# EAGLE board robot_board (EAGLE 6.5.0), part 1 of 2
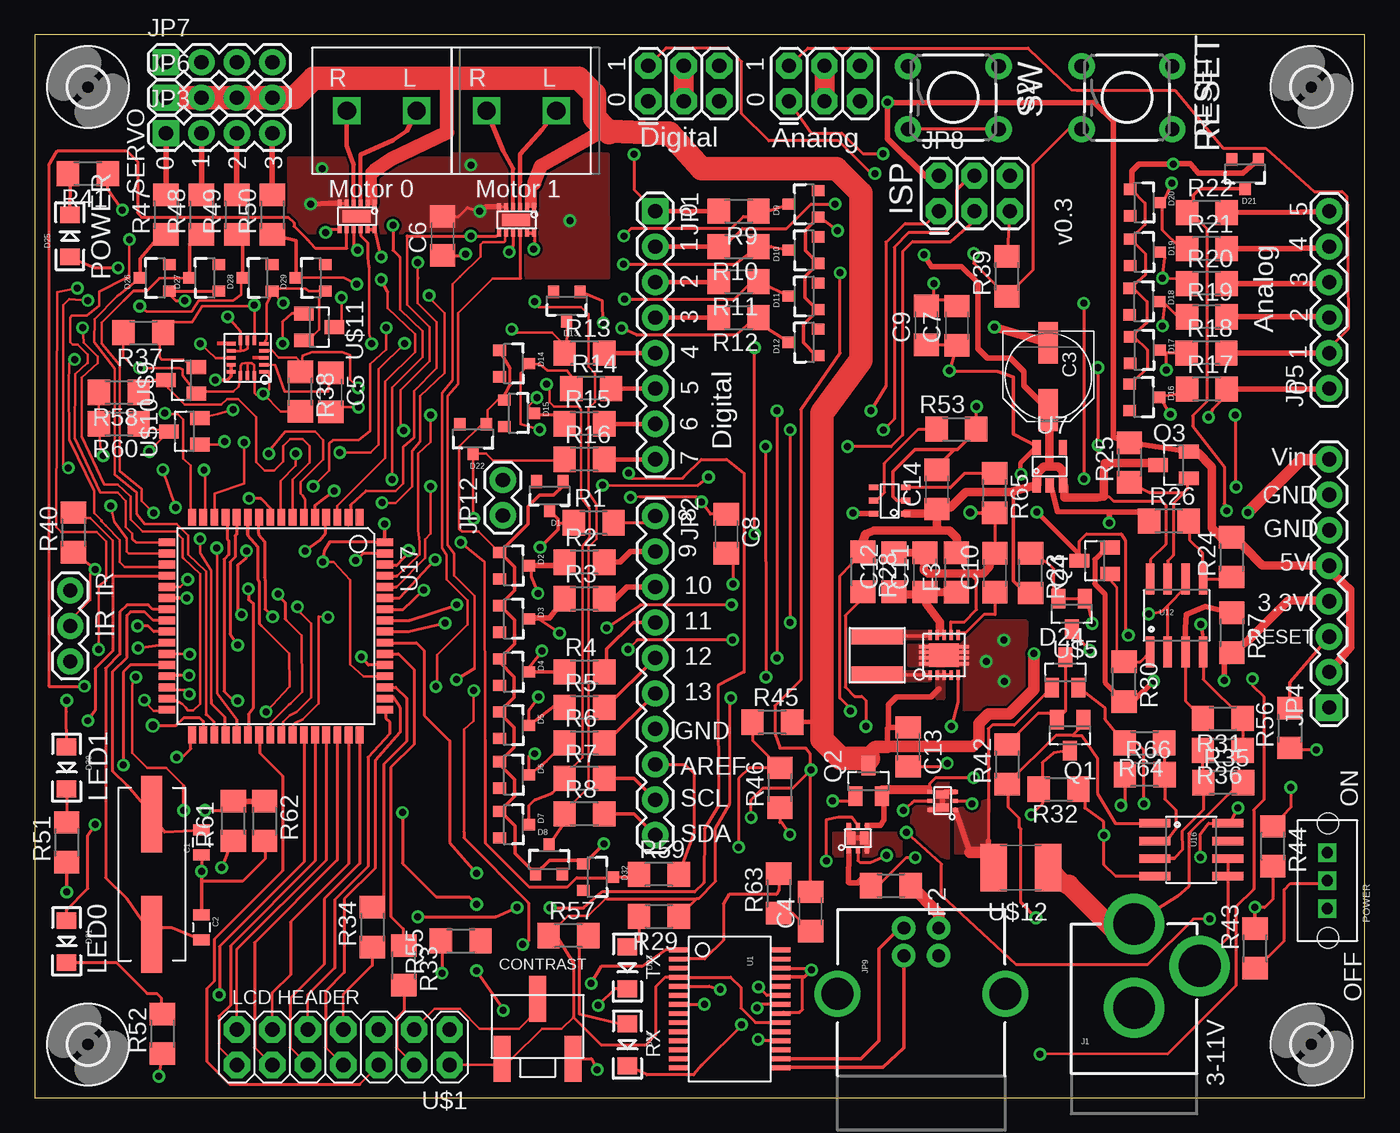
[diagram p1: board, top side]
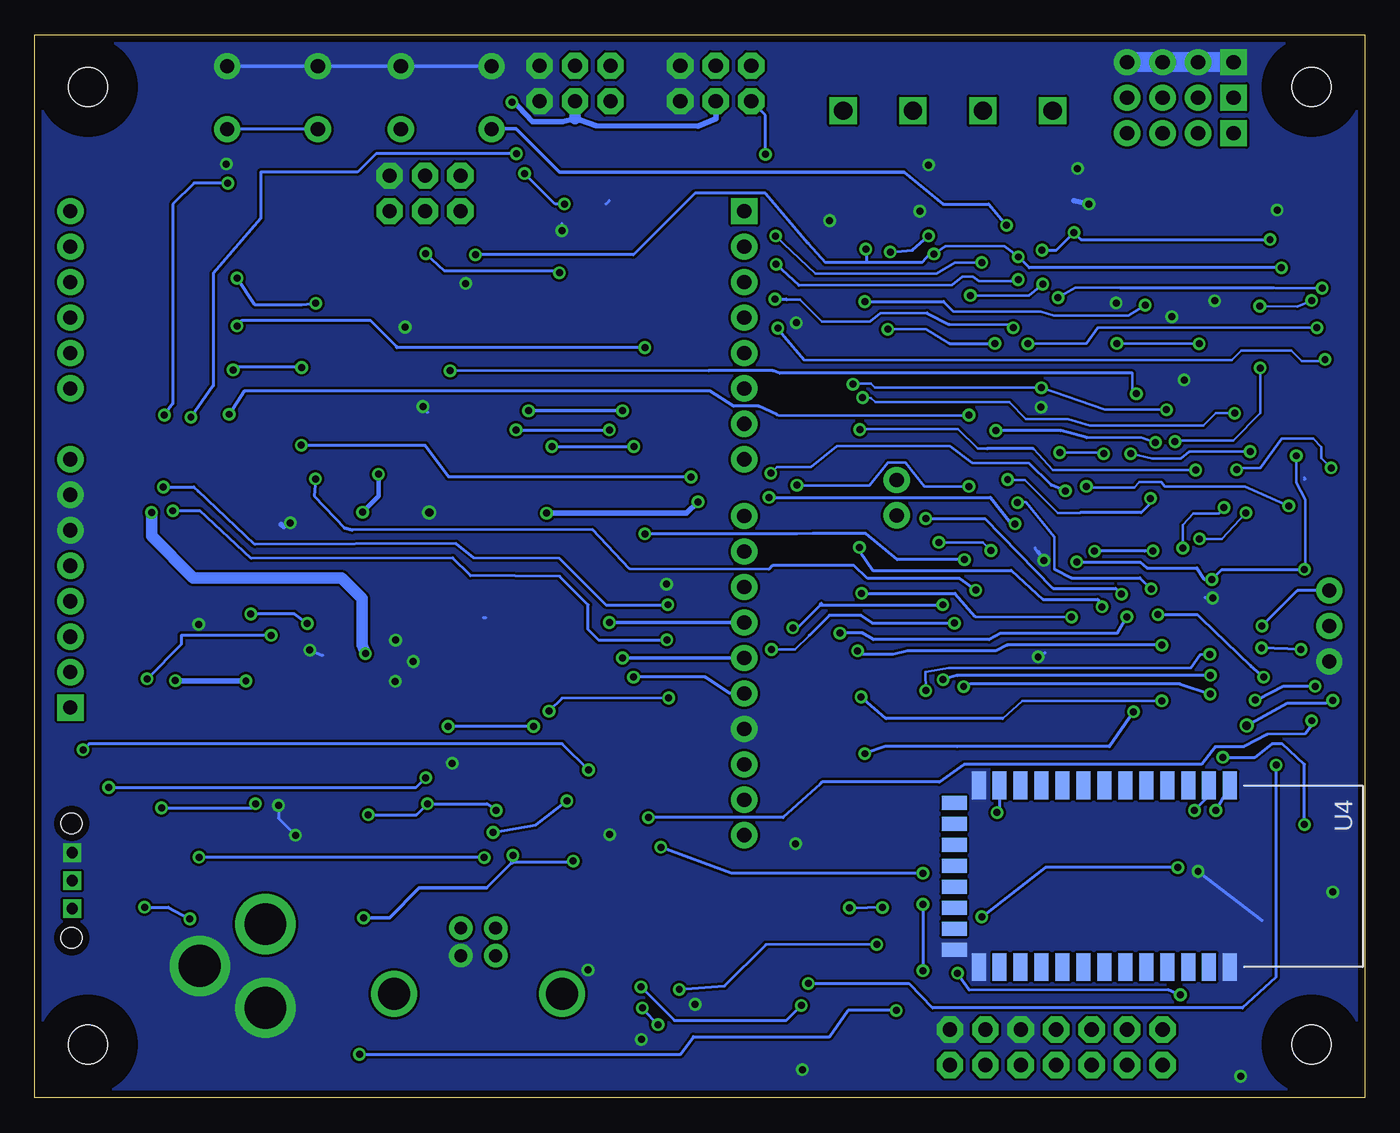
[diagram p2: board, bottom side, seen from below]

Size 95.24 x 76.12 mm. Coordinates in mm from the lower left corner, seen from the top.
Outline: 95.24,0 95.24,76.12 0,76.12 0,0 95.24,0
Copper layers (1*16): Top 0.035mm / dielectric 1.5mm / Bottom 0.035mm
Design rules "default *": minimum track width 7mil, minimum drill 19mil, track to track 7mil, track to pad 8mil, pad to pad 8mil, via to via 8mil, smd to smd 1mil, copper to edge 20mil, drill to drill 8mil, minimum pad ring 10mil, minimum via ring 8mil, stop-mask expansion 4mil, vias tented up to drill 0mil, thermal gap 10mil

## Footprints (pad centres in the part's own frame; a part is rotated, then mirrored left to right if it is on the bottom)
0805 = smd 0.8 x 1.2: 1 -0.9,0; 2 0.9,0
PANASONIC_D = smd 3 x 1.4: + 2.4,0; - -2.4,0
C1206 = smd 1.6 x 1.8: 1 -1.4,0; 2 1.4,0
SOT23-3 = smd 0.8 x 0.9: 1 -0.95,-1; 2 0.95,-1; 3 0,1.1
LED-1206 = smd 1.2 x 1.4: A -1.5,0; C 1.5,0
SOT23 = smd 1 x 1.4: 1 -0.95,-1.1; 2 0.95,-1.1; 3 0,1.1
R1206 = smd 1.6 x 1.803: 1 -1.422,0; 2 1.422,0
2,8 = hole 2.8: 0,0
1X03 = drill 1.016 pad 1.88: 1 0,0; 2 2.54,0; 3 5.08,0
POWER_JACK_PTH = drill 2.997 pad 4.318: GND 0,7.7; GNDBREAK 4.7,10.7; PWR 0,13.7
1X08 = drill 1.016 pad 1.88 square: 1 0,0 | drill 1.016 pad 1.88: 2 2.54,0; 3 5.08,0; 4 7.62,0; 5 10.16,0; 6 12.7,0; 7 15.24,0; 8 17.78,0
1X10 = drill 1.016 pad 1.88: 1 0,0; 2 2.54,0; 3 5.08,0; 4 7.62,0; 5 10.16,0; 6 12.7,0; 7 15.24,0; 8 17.78,0; 9 20.32,0; 10 22.86,0
1X04 = drill 1.016 pad 1.88 square: 1 0,0 | drill 1.016 pad 1.88: 2 2.54,0; 3 5.08,0; 4 7.62,0
1X06 = drill 1.016 pad 1.88: 1 0,0; 2 2.54,0; 3 5.08,0; 4 7.62,0; 5 10.16,0; 6 12.7,0
2X3 = drill 1.016 pad 1.88 octagon: 1 0,0; 2 0,2.54; 3 2.54,0; 4 2.54,2.54; 5 5.08,0; 6 5.08,2.54
USB-B-PTH = drill 0.914 pad 1.676: D+ 0,1.25; D- 1.981,1.25; GND 0,-1.25; VBUS 1.981,-1.25 | drill 2.286: S1 -2.718,-6.02; S2 -2.718,6.02
1X02 = drill 1.016 pad 1.88: 1 0,0; 2 2.54,0
SW = drill 0.8 square: P$1 0,0; P$2 2,0; P$3 -2,0 | hole 1.5: -4.1,-0.04; 4.1,-0.04
SOT23@1 = smd 1 x 1.4: 1 -0.95,-1.1; 2 0.95,-1.1; 3 0,1.1
TACTILE-PTH = drill 1.016 pad 1.88: 1 -3.251,2.261; 2 3.251,2.261; 3 -3.251,-2.261; 4 3.251,-2.261
SSOP28DB = smd 0.348 x 1.397: 1 -4.225,-3.656; 2 -3.575,-3.656; 3 -2.925,-3.656; 4 -2.275,-3.656; 5 -1.625,-3.656; 6 -0.975,-3.656; 7 -0.325,-3.656; 8 0.325,-3.656; 9 0.975,-3.656; 10 1.625,-3.656; 11 2.275,-3.656; 12 2.925,-3.656; 13 3.575,-3.656; 14 4.225,-3.656; 15 4.225,3.656; 16 3.575,3.656; 17 2.925,3.656; 18 2.275,3.656; 19 1.625,3.656; 20 0.975,3.656; 21 0.325,3.656; 22 -0.325,3.656; 23 -0.975,3.656; 24 -1.625,3.656; 25 -2.275,3.656; 26 -2.925,3.656; 27 -3.575,3.656; 28 -4.225,3.656
BLUETOOTH_SMD = smd 2 x 1: 1 0,0; 2 0,-1.5; 3 0,-3; 4 0,-4.5; 5 0,-6; 6 0,-7.5; 7 0,-9; 8 0,-10.5; 9 0,-12; 10 0,-13.5; 11 0,-15; 12 0,-16.5; 13 0,-18; 22 13,-18; 23 13,-16.5; 24 13,-15; 25 13,-13.5; 26 13,-12; 27 13,-10.5; 28 13,-9; 29 13,-7.5; 30 13,-6; 31 13,-4.5; 32 13,-3; 33 13,-1.5; 34 13,0 | smd 1 x 1.8: 14 1.25,-19.75; 15 2.75,-19.75; 16 4.25,-19.75; 17 5.75,-19.75; 18 7.25,-19.75; 19 8.75,-19.75; 20 10.25,-19.75; 21 11.75,-19.75
SOT-23-5 = smd 1.05 x 0.6: P$1 0.53,2.24; P$2 0.53,1.29; P$3 0.53,0.34; P$4 3.23,2.24; P$5 3.23,0.35
SOT23-M5 = smd 0.4 x 0.7: P$1 -0.62,-0.35; P$2 0.33,-0.35; P$3 1.28,-0.35; P$4 1.28,1.94; P$5 0.33,1.94; P$6 -0.62,1.94
PWSON-N12 = smd 2 x 0.9: GND 0.82,0.63 | smd 0.28 x 0.5: P$1 -0.46,-0.32; P$2 0.04,-0.32; P$3 0.54,-0.32; P$4 1.04,-0.32; P$5 1.54,-0.32; P$6 2.04,-0.32; P$7 -0.46,1.58; P$8 0.04,1.58; P$9 0.54,1.58; P$10 1.04,1.58; P$11 1.54,1.58; P$12 2.04,1.58
SO08 = smd 0.61 x 2.21: 1 -1.905,-2.616; 2 -0.635,-2.616; 3 0.635,-2.616; 4 1.905,-2.616; 5 1.905,2.616; 6 0.635,2.616; 7 -0.635,2.616; 8 -1.905,2.616
TQFP64 = smd 1.194 x 0.559: 1 -7.8,6; 2 -7.8,5.2; 3 -7.8,4.4; 4 -7.8,3.6; 5 -7.8,2.8; 6 -7.8,2; 7 -7.8,1.2; 8 -7.8,0.4; 9 -7.8,-0.4; 10 -7.8,-1.2; 11 -7.8,-2; 12 -7.8,-2.8; 13 -7.8,-3.6; 14 -7.8,-4.4; 15 -7.8,-5.2; 16 -7.8,-6; 33 7.8,-6; 34 7.8,-5.2; 35 7.8,-4.4; 36 7.8,-3.6; 37 7.8,-2.8; 38 7.8,-2; 39 7.8,-1.2; 40 7.8,-0.4; 41 7.8,0.4; 42 7.8,1.2; 43 7.8,2; 44 7.8,2.8; 45 7.8,3.6; 46 7.8,4.4; 47 7.8,5.2; 48 7.8,6 | smd 0.559 x 1.194: 17 -6,-7.8; 18 -5.2,-7.8; 19 -4.4,-7.8; 20 -3.6,-7.8; 21 -2.8,-7.8; 22 -2,-7.8; 23 -1.2,-7.8; 24 -0.4,-7.8; 25 0.4,-7.8; 26 1.2,-7.8; 27 2,-7.8; 28 2.8,-7.8; 29 3.6,-7.8; 30 4.4,-7.8; 31 5.2,-7.8; 32 6,-7.8; 49 6,7.8; 50 5.2,7.8; 51 4.4,7.8; 52 3.6,7.8; 53 2.8,7.8; 54 2,7.8; 55 1.2,7.8; 56 0.4,7.8; 57 -0.4,7.8; 58 -1.2,7.8; 59 -2,7.8; 60 -2.8,7.8; 61 -3.6,7.8; 62 -4.4,7.8; 63 -5.2,7.8; 64 -6,7.8
2X7 = drill 1.016 pad 1.88 octagon: 1 0,0; 2 0,2.54; 3 2.54,0; 4 2.54,2.54; 5 5.08,0; 6 5.08,2.54; 7 7.62,0; 8 7.62,2.54; 9 10.16,0; 10 10.16,2.54; 11 12.7,0; 12 12.7,2.54; 13 15.24,0; 14 15.24,2.54
POT = smd 1.194 x 3.302: 1 -2.54,0; 2 0,4.318; 3 2.54,0
WSON-10 = smd 0.7 x 0.25: GND@N1 -1.43,0.6; GND@N2 -1.43,0.2; GND@N3 -1.43,-0.2; GND@N4 -1.43,-0.6; GND@N5 1.43,0.6; GND@N6 1.43,0.2; GND@N7 1.43,-0.2; GND@N8 1.43,-0.6 | smd 0.25 x 0.7: P$1 -1,-1.44; P$2 -0.5,-1.44; P$3 0,-1.44; P$4 0.5,-1.44; P$5 1,-1.43; P$6 1,1.44; P$7 0.5,1.44; P$8 0,1.44; P$9 -0.5,1.44; P$10 -1,1.44 | smd 2.16 x 1.7: P$11 0,0
TAIYO4012 = smd 1.2 x 3.7: P$1 1.4,0; P$2 -1.4,0
SC70T = smd 0.3 x 0.35: D1@1 -0.65,0.89; D2@1 0.65,-0.94; G1 0,-0.94; G2 0,0.89; S1 -0.65,-0.94; S2 0.65,0.89 | smd 0.6 x 0.95: D1@2 -0.47,-0.02; D2@2 0.46,-0.02
QFN-COL = smd 0.67 x 0.25: P$1 -1.17,0.99; P$2 -1.17,0.49; P$3 -1.17,-0.01; P$4 -1.17,-0.51; P$5 -1.17,-1.01; P$9 1.17,-1; P$10 1.17,-0.5; P$11 1.17,0; P$12 1.17,0.5; P$13 1.17,1 | smd 0.25 x 0.67: P$6 -0.5,-1.26; P$7 0,-1.26; P$8 0.5,-1.26; P$14 0.5,1.26; P$15 0,1.26; P$16 -0.5,1.26
C1812 = smd 1.9 x 3.4: 1 -1.95,0; 2 1.95,0
2POS_TERMINAL = drill 1.3 square: L -5,0; R 0,0
CRYSTAL-SMD-10.5X4.8-2PIN = smd 5.5 x 1.5: P$1 -4.3,0; P$2 4.3,0

## Placement (x,y rotation side)
C1  22pF  [0805]  11.93,18.29 90 top
C2  22pF  [0805]  11.93,12.19 270 top
C3  100uF  [PANASONIC_D]  72.58,51.66 270 top
C4  .1uF  [C1206]  55.57,13.34 90 top
C5  .1uF  [C1206]  21.2,50.52 270 top
C6  .1uF  [C1206]  29.2,61.72 90 top
C7  22uF  [C1206]  66.03,55.3 90 top
C8  .1uF  [C1206]  49.52,40.39 270 top
C9  1uF  [C1206]  63.85,55.32 90 top
C10  .1uF  [C1206]  68.75,37.59 90 top
C11  22uF  [C1206]  63.74,37.62 90 top
C12  22uF  [C1206]  61.53,37.64 90 top
C13  22uF  [C1206]  62.55,25.12 270 top
C14  1uF  [C1206]  64.61,43.56 90 top
D1  5.1V  [SOT23-3]  36.87,43.13 180 top
D2  5.1V  [SOT23-3]  34.28,38.1 270 top
D3  5.1V  [SOT23-3]  34.28,34.29 270 top
D4  5.1V  [SOT23-3]  34.28,30.48 270 top
D5  5.1V  [SOT23-3]  34.28,26.67 270 top
D6  5.1V  [SOT23-3]  34.28,23.11 270 top
D7  5.1V  [SOT23-3]  34.28,19.56 270 top
D8  5.1V  [SOT23-3]  36.82,17.02 0 top
D9  5.1V  [SOT23-3]  55.11,64.01 90 top
D10  5.1V  [SOT23-3]  55.11,60.71 90 top
D11  5.1V  [SOT23-3]  55.11,57.4 90 top
D12  5.1V  [SOT23-3]  55.11,54.1 90 top
D13  5.1V  [SOT23-3]  38.09,56.72 180 top
D14  5.1V  [SOT23-3]  34.28,52.58 270 top
D15  5.1V  [SOT23-3]  34.64,49.02 270 top
D16  5.1V  [SOT23-3]  79.42,50.16 270 top
D17  5.1V  [SOT23-3]  79.44,53.54 270 top
D18  5.1V  [SOT23-3]  79.42,57.02 270 top
D19  5.1V  [SOT23-3]  79.44,60.55 270 top
D20  5.1V  [SOT23-3]  79.44,64.11 270 top
D21  5.1V  [SOT23-3]  86.68,66.19 180 top
D22  5.1V  [SOT23-3]  31.38,47.22 180 top
D23  RX  [LED-1206]  42.43,9.3 270 top
D24  BAT54C  [SOT23]  73.8,30.45 0 top
D25  POWER  [LED-1206]  2.5,61.72 90 top
D26  5.1V  [SOT23-3]  8.63,58.72 90 top
D27  5.1V  [SOT23-3]  12.18,58.72 90 top
D28  5.1V  [SOT23-3]  15.99,58.72 90 top
D29  5.1V  [SOT23-3]  19.8,58.72 90 top
D30  GREEN  [LED-1206]  2.28,23.62 270 top
D31  YELLOW  [LED-1206]  2.28,11.18 270 top
D32  5.1V  [SOT23-3]  40.27,15.8 270 top
D34  RX  [LED-1206]  42.43,3.78 270 top
F2  1206PPTC_FUSE  [R1206]  61.31,15.19 180 top
F3  1206PPTC_FUSE  [R1206]  66,37.62 90 top
H1  MOUNT-HOLE2.8  [2,8]  3.8,3.81 90 top
H2  MOUNT-HOLE2.8  [2,8]  3.8,72.39 90 top
H3  MOUNT-HOLE2.8  [2,8]  91.43,3.81 90 top
H4  MOUNT-HOLE2.8  [2,8]  91.43,72.39 90 top
IR  [1X03]  2.53,36.32 270 top
J1  POWER_JACKPTH  [POWER_JACK_PTH]  78.73,-1.27 0 top
JP1  [1X08]  44.44,63.5 270 top
JP2  M10"  [1X10]  44.44,41.66 270 top
JP3  [1X04]  9.39,69.09 0 top
JP4  [1X08]  92.7,27.94 90 top
JP5  [1X06]  92.7,50.8 90 top
JP6  [1X04]  9.39,71.63 0 top
JP7  [1X04]  9.39,74.17 0 top
JP8  [2X3]  64.76,63.5 0 top
JP9  USB-B  [USB-B-PTH]  63.49,10.16 90 top
JP10  [2X3]  54.02,71.37 0 top
JP11  [2X3]  43.93,71.37 0 top
JP12  M02PTH  [1X02]  33.52,41.71 90 top
POWER  SW  [SW]  92.57,15.54 90 top
Q1  DMP2035U  [SOT23]  74.13,25.96 180 top
Q2  DMP2035U  [SOT23]  59.71,22.68 0 top
Q3  DMP2035U-7  [SOT23@1]  81.55,45.31 90 top
Q4  DMP2035U-7  [SOT23@1]  75.91,38.46 90 top
R1  300  [R1206]  40.02,41.17 0 top
R2  300  [R1206]  39.36,38.35 0 top
R3  300  [R1206]  39.36,35.74 0 top
R4  300  [R1206]  39.36,30.48 0 top
R5  300  [R1206]  39.36,27.94 0 top
R6  300  [R1206]  39.36,25.4 0 top
R7  300  [R1206]  39.36,22.86 0 top
R8  300  [R1206]  39.36,20.32 0 top
R9  300  [R1206]  50.41,63.5 180 top
R10  300  [R1206]  50.41,60.96 180 top
R11  300  [R1206]  50.41,58.45 180 top
R12  300  [R1206]  50.41,55.88 180 top
R13  300  [R1206]  39.36,53.34 0 top
R14  300  [R1206]  39.84,50.8 0 top
R15  300  [R1206]  39.36,48.26 0 top
R16  300  [R1206]  39.36,45.72 0 top
R17  300  [R1206]  83.94,50.75 0 top
R18  300  [R1206]  83.91,53.34 0 top
R19  300  [R1206]  83.94,55.93 0 top
R20  300  [R1206]  83.94,58.32 0 top
R21  300  [R1206]  83.94,60.81 0 top
R22  300  [R1206]  83.94,63.4 0 top
R23  1K 1%  [R1206]  71.31,37.57 270 top
R24  24K 1%  [R1206]  85.71,38.71 90 top
R25  20K 1%  [R1206]  78.4,45.49 90 top
R26  20K 1%  [R1206]  81.22,41.3 0 top
R27  10K 1%  [R1206]  85.74,33.3 270 top
R28  1M  [R1206]  59.3,37.67 270 top
R29  330  [R1206]  44.69,12.98 180 top
R30  20K 1%  [R1206]  78.02,29.79 270 top
R31  24K 1%  [R1206]  85.08,27.15 180 top
R32  20K 1%  [R1206]  73.32,22.1 180 top
R33  300  [R1206]  26.43,9.47 270 top
R34  300  [R1206]  24.17,12.22 90 top
R35  120K 1%  [R1206]  85.11,22.56 0 top
R36  604K 1%  [R1206]  85.08,24.87 180 top
R37  10K 1%  [R1206]  7.76,54.79 180 top
R38  10K 1%  [R1206]  19.01,50.57 270 top
R39  1K 1%  [R1206]  69.61,58.83 90 top
R40  10K 1%  [R1206]  2.76,40.49 90 top
R41  330  [R1206]  3.8,66.19 180 top
R42  10K 1%  [R1206]  69.64,23.88 90 top
R43  1K 1%  [R1206]  87.39,10.69 270 top
R44  100K 1%  [R1206]  88.66,18.01 270 top
R45  100K 1%  [R1206]  52.82,26.9 0 top
R46  100K 1%  [R1206]  53.36,22.2 90 top
R47  300  [R1206]  9.39,63.25 90 top
R48  300  [R1206]  11.93,63.25 90 top
R49  300  [R1206]  14.47,63.25 90 top
R50  300  [R1206]  17.01,63.25 90 top
R51  330  [R1206]  2.28,18.29 90 top
R52  330  [R1206]  9.13,4.57 90 top
R53  1.5K 1%  [R1206]  66,47.88 180 top
R55  1K  [R1206]  30.5,11.23 180 top
R56  1K  [R1206]  89.88,26.47 90 top
R57  330  [R1206]  38.22,11.61 0 top
R58  10K 1%  [R1206]  6.01,50.52 180 top
R59  1K  [R1206]  44.69,16 0 top
R60  10K 1%  [R1206]  6.01,48.26 180 top
R61  1K  [R1206]  14.21,19.81 270 top
R62  2K  [R1206]  16.45,19.81 90 top
R63  1K 1%  [R1206]  53.28,14.63 90 top
R64  120K 1%  [R1206]  79.47,25.4 180 top
R65  1K 1%  [R1206]  68.75,43.31 270 top
R66  120K 1%  [R1206]  79.49,23.14 0 top
RESET  [TACTILE-PTH]  78.22,71.63 0 top
S2  [TACTILE-PTH]  65.78,71.63 0 top
U1  FT232RL-BASICSSOP  [SSOP28DB]  49.77,6.35 270 top
U4  HC_05  [BLUETOOTH_SMD]  9.64,22.35 270 bottom
U7  TLV70233  [SOT-23-5]  73.98,43.33 90 top
U8  MIC2009A  [SOT23-M5]  62.02,42.44 90 top
U9  DRV8839  [PWSON-N12]  35.3,63.5 180 top
U10  DRV8839  [PWSON-N12]  23.87,63.75 180 top
U12  LM393  [SO08]  81.78,34.54 0 top
U16  LM393  [SO08]  82.82,17.75 270 top
U17  ATMEGA325PA  [TQFP64]  17.26,33.78 270 top
U$1  2X7HEADER  [2X7]  29.71,4.88 180 top
U$2  POT  [POT]  36.01,2.77 0 top
U$3  TPS63061  [WSON-10]  65.12,31.7 0 top
U$4  1uH  [TAIYO4012]  60.34,31.67 270 top
U$5  AP431SAG-7  [SOT23]  74.26,34.65 180 top
U$6  SIA907EDJT  [SC70T]  64.99,21.26 90 top
U$7  SIA907EDJT  [SC70T]  58.94,18.62 0 top
U$8  MMA8453Q  [QFN-COL]  15.23,52.98 180 top
U$9  BSS138  [SOT23]  10.48,51.38 90 top
U$10  BSS138  [SOT23]  10.71,47.73 90 top
U$11  BSS138  [SOT23]  20.36,55.19 270 top
U$12  PTS181224V150  [C1812]  70.63,16.48 180 top
U$19  2POS_TERMINAL  [2POS_TERMINAL]  32.35,70.69 180 top
U$20  2POS_TERMINAL  [2POS_TERMINAL]  22.34,70.69 180 top
Y1  16MHz  [CRYSTAL-SMD-10.5X4.8-2PIN]  8.37,16 270 top